# EAGLE schematic Motor-Aufsatz-Grundriss (EAGLE 5.02)
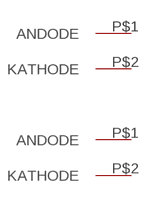
[diagram p0: schematic, sheet 1]

## Parts
U$1  RPI-243-LED  [RPI-243-LED]
U$2  RPI-243-LED  [RPI-243-LED]
Unconnected: U$1.P$1(ANDODE) U$1.P$2(KATHODE) U$2.P$1(ANDODE) U$2.P$2(KATHODE)

## Library data of the parts
U$1 U$2 = olaf:RPI-243-LED